# EAGLE schematic PID Board (EAGLE 8.3.2)
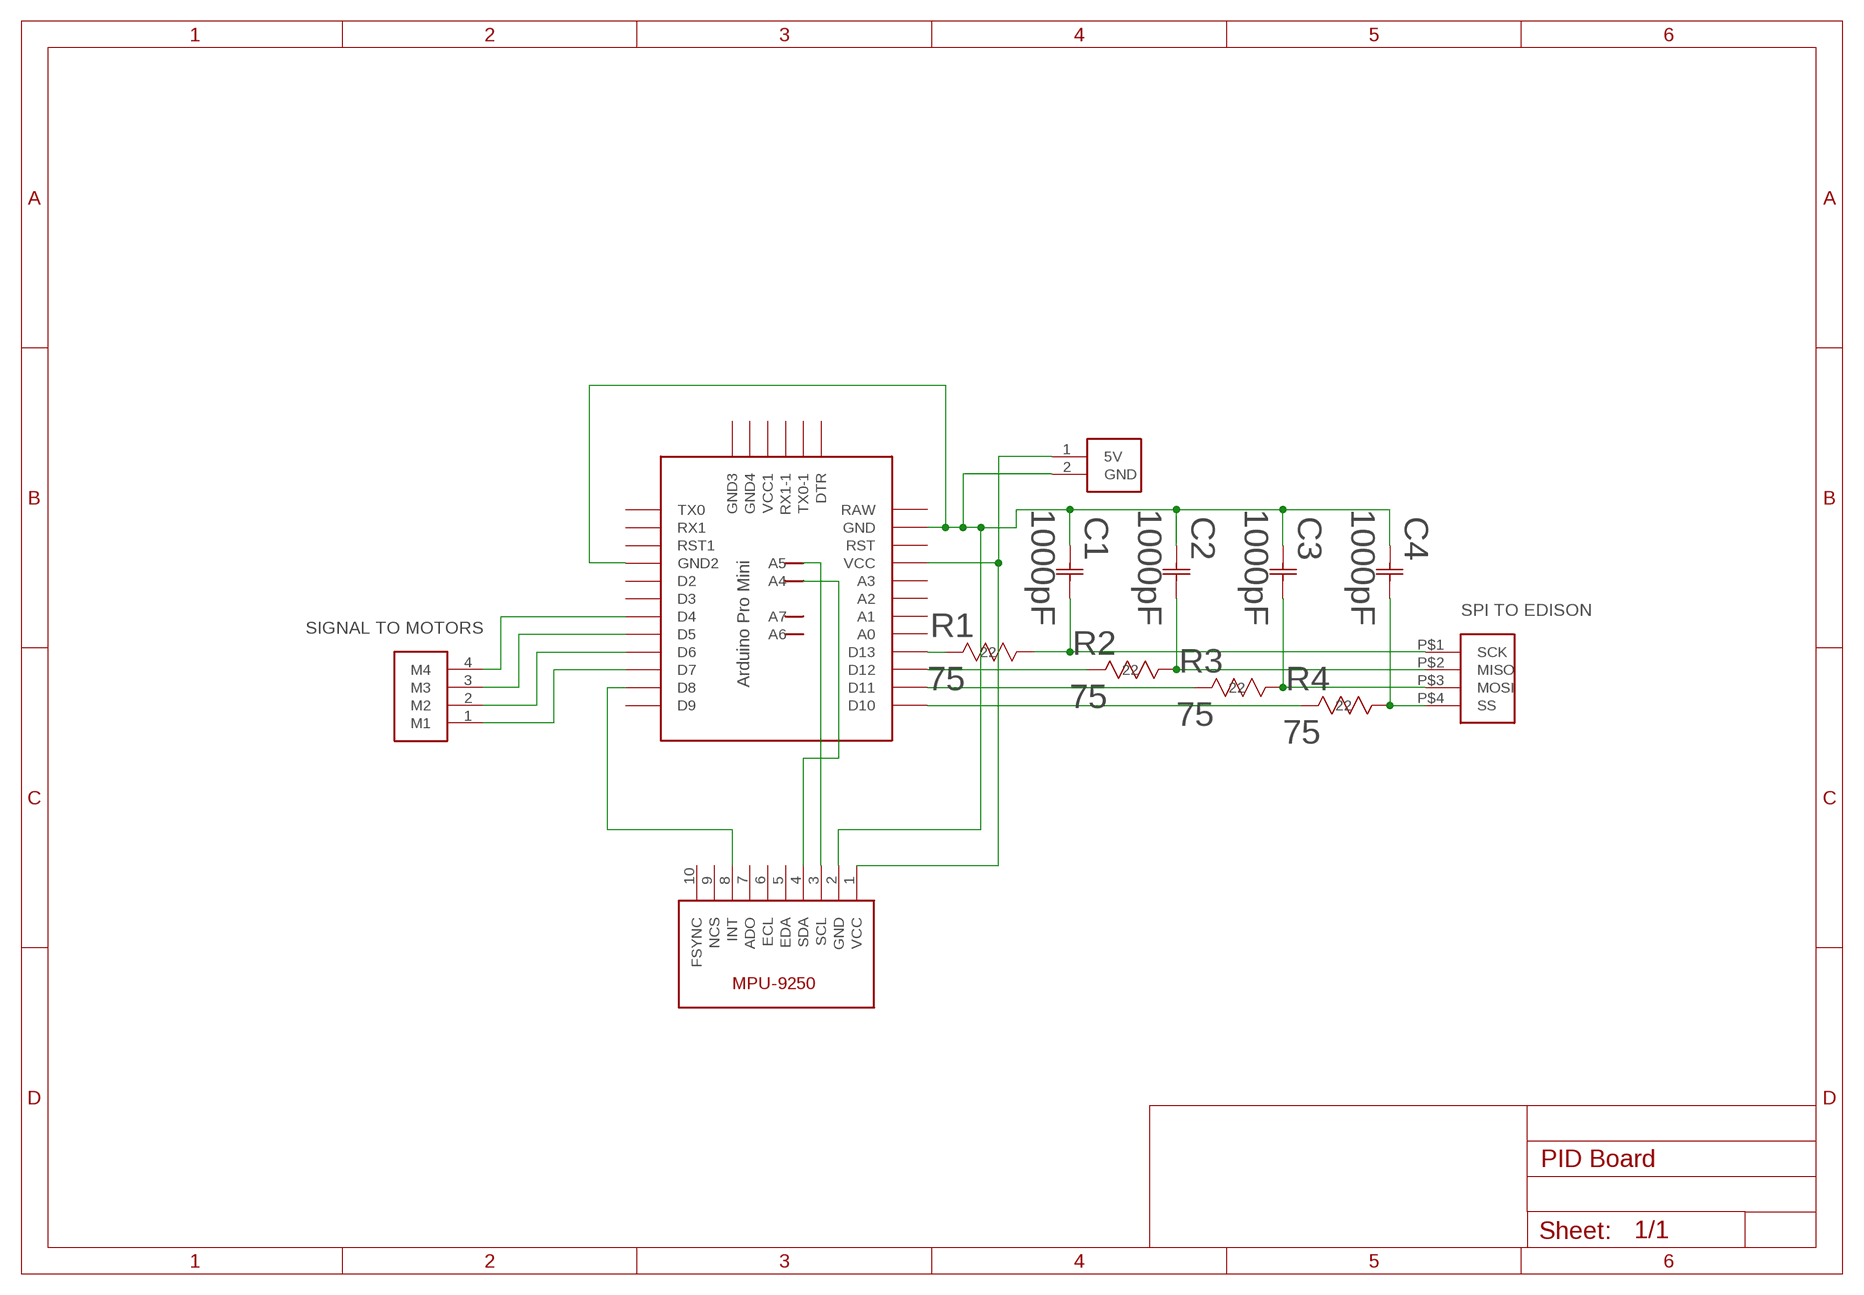
[diagram p0: schematic, sheet 1]

## Parts
C1  1000pF  GRM155R60J102KA01DG-155-M  [G-155-M]
C2  1000pF  GRM155R60J102KA01DG-155-M  [G-155-M]
C3  1000pF  GRM155R60J102KA01DG-155-M  [G-155-M]
C4  1000pF  GRM155R60J102KA01DG-155-M  [G-155-M]
J1  POWER_CONNECTOR  [XH_CONNECTOR]
J2  SPI_CONNECTOR  [JST-XH_4POS]
J3  4_PIN_CONNECTOR  [4_PIN_CONNECTOR]
R1  75  RC0402JR-0775RLRC0402N-M  [RC0402N-M]
R2  75  RC0402JR-0775RLRC0402N-M  [RC0402N-M]
R3  75  RC0402JR-0775RLRC0402N-M  [RC0402N-M]
R4  75  RC0402JR-0775RLRC0402N-M  [RC0402N-M]
U1  PRO-MINI-2  [PRO-MINI-2]
U2  MPU-9250  [MPU-9250]

## Nets
GND: C1.1 C2.1 C3.1 C4.1 J1.2(GND) U1.GND U1.GND1(GND2) U2.2(GND)
N$1: J1.1(5V) U1.VCC U2.1(VCC)
N$2: R1.2 U1.D13
N$3: U1.D8 U2.8(INT)
N$4: U1.A4 U2.4(SDA)
N$5: U1.A5 U2.3(SCL)
N$6: R2.2 U1.D12
N$7: R3.2 U1.D11
N$8: R4.2 U1.D10
N$9: C4.2 J2.P$4(SS) R4.1
N$10: J3.1(M1) U1.D7
N$11: J3.2(M2) U1.D6
N$12: J3.3(M3) U1.D5
N$13: J3.4(M4) U1.D4
N$14: C3.2 J2.P$3(MOSI) R3.1
N$15: C2.2 J2.P$2(MISO) R2.1
N$16: C1.2 J2.P$1(SCK) R1.1
Unconnected: U1.A0 U1.A1 U1.A2 U1.A3 U1.A6 U1.A7 U1.D2 U1.D3 U1.D9 U1.DTR U1.GND2(GND3) U1.GND3(GND4) U1.RAW U1.RST U1.RST1 U1.RX1 U1.RX1-1 U1.TX0 U1.TX0-1 U1.VCC1 U2.5(EDA) U2.6(ECL) U2.7(ADO) U2.9(NCS) U2.10(FSYNC)

## Notes on the sheet
- SPI TO EDISON
- SIGNAL TO MOTORS

## Library data of the parts
C1-C4 = 1000pF-capacitor:GRM155R60J102KA01D; COPYRIGHT: Copyright C 2015 Accelerated Designs. All rights reserved; MANUFACTURER_PART_NUMBER: GRM155R60J102KA01D; VENDOR: Vendor
J1 = thanics_robotics:POWER_CONNECTOR
J2 = thanics_robotics:SPI_CONNECTOR
J3 = thanics_robotics:4_PIN_CONNECTOR
R1-R4 = 75-resistor:RC0402JR-0775RL; CASE: 0402 1005 metric; COMPOSITION: Thick Film; COPYRIGHT: Copyright C 2015 Accelerated Designs. All rights reserved; DATASHEET: httpwww.yageo.comdocumentsrecentPYuRC0402_51_RoHS_L_6.pdf; DESCRIPTION: RES 75 OHM 116W 5% 0402 SMD; DIGIKEYPARTNUMBER: 31175JRTRND; HEIGHT: 0.016" 0.40mm; LEADSTYLE: Surface Mount SMD SMT; MANUFACTURER_PART_NUMBER: RC0402JR0775RL; NEWARKPARTNUMBER: 66R1890; NUMBEROFTERMINATIONS: 2; PACKAGECASE: 0402 1005 Metric; PACKAGING: Tape &amp Reel TR; POWERWATTS: 0.063W 116W; QUANTITY_AVAILABLE: 60000; RESISTANCEINOHMS: 75.0; RESISTANCEOHMS: 75; SIZEDIMENSION: 0.039" L x 0.020" W 1.00mm x 0.50mm; TEMPERATURECOEFFICIENT: 100ppm°C; TOLERANCE: 5%; VENDOR: Yageo; VOLTAGEWORKING: 50V
U1 = Arduino-clone:PRO-MINI-2: Arduino Pro Mini Layout 2 Sparkfun.com
U2 = thanics_robotics:MPU-9250